# Altium schematic sheet Encoder.SchDoc
size B; Author: E. Sims; Organization: Let's Build Rockets Inc.; SheetNumber: 2; SheetTotal: 3
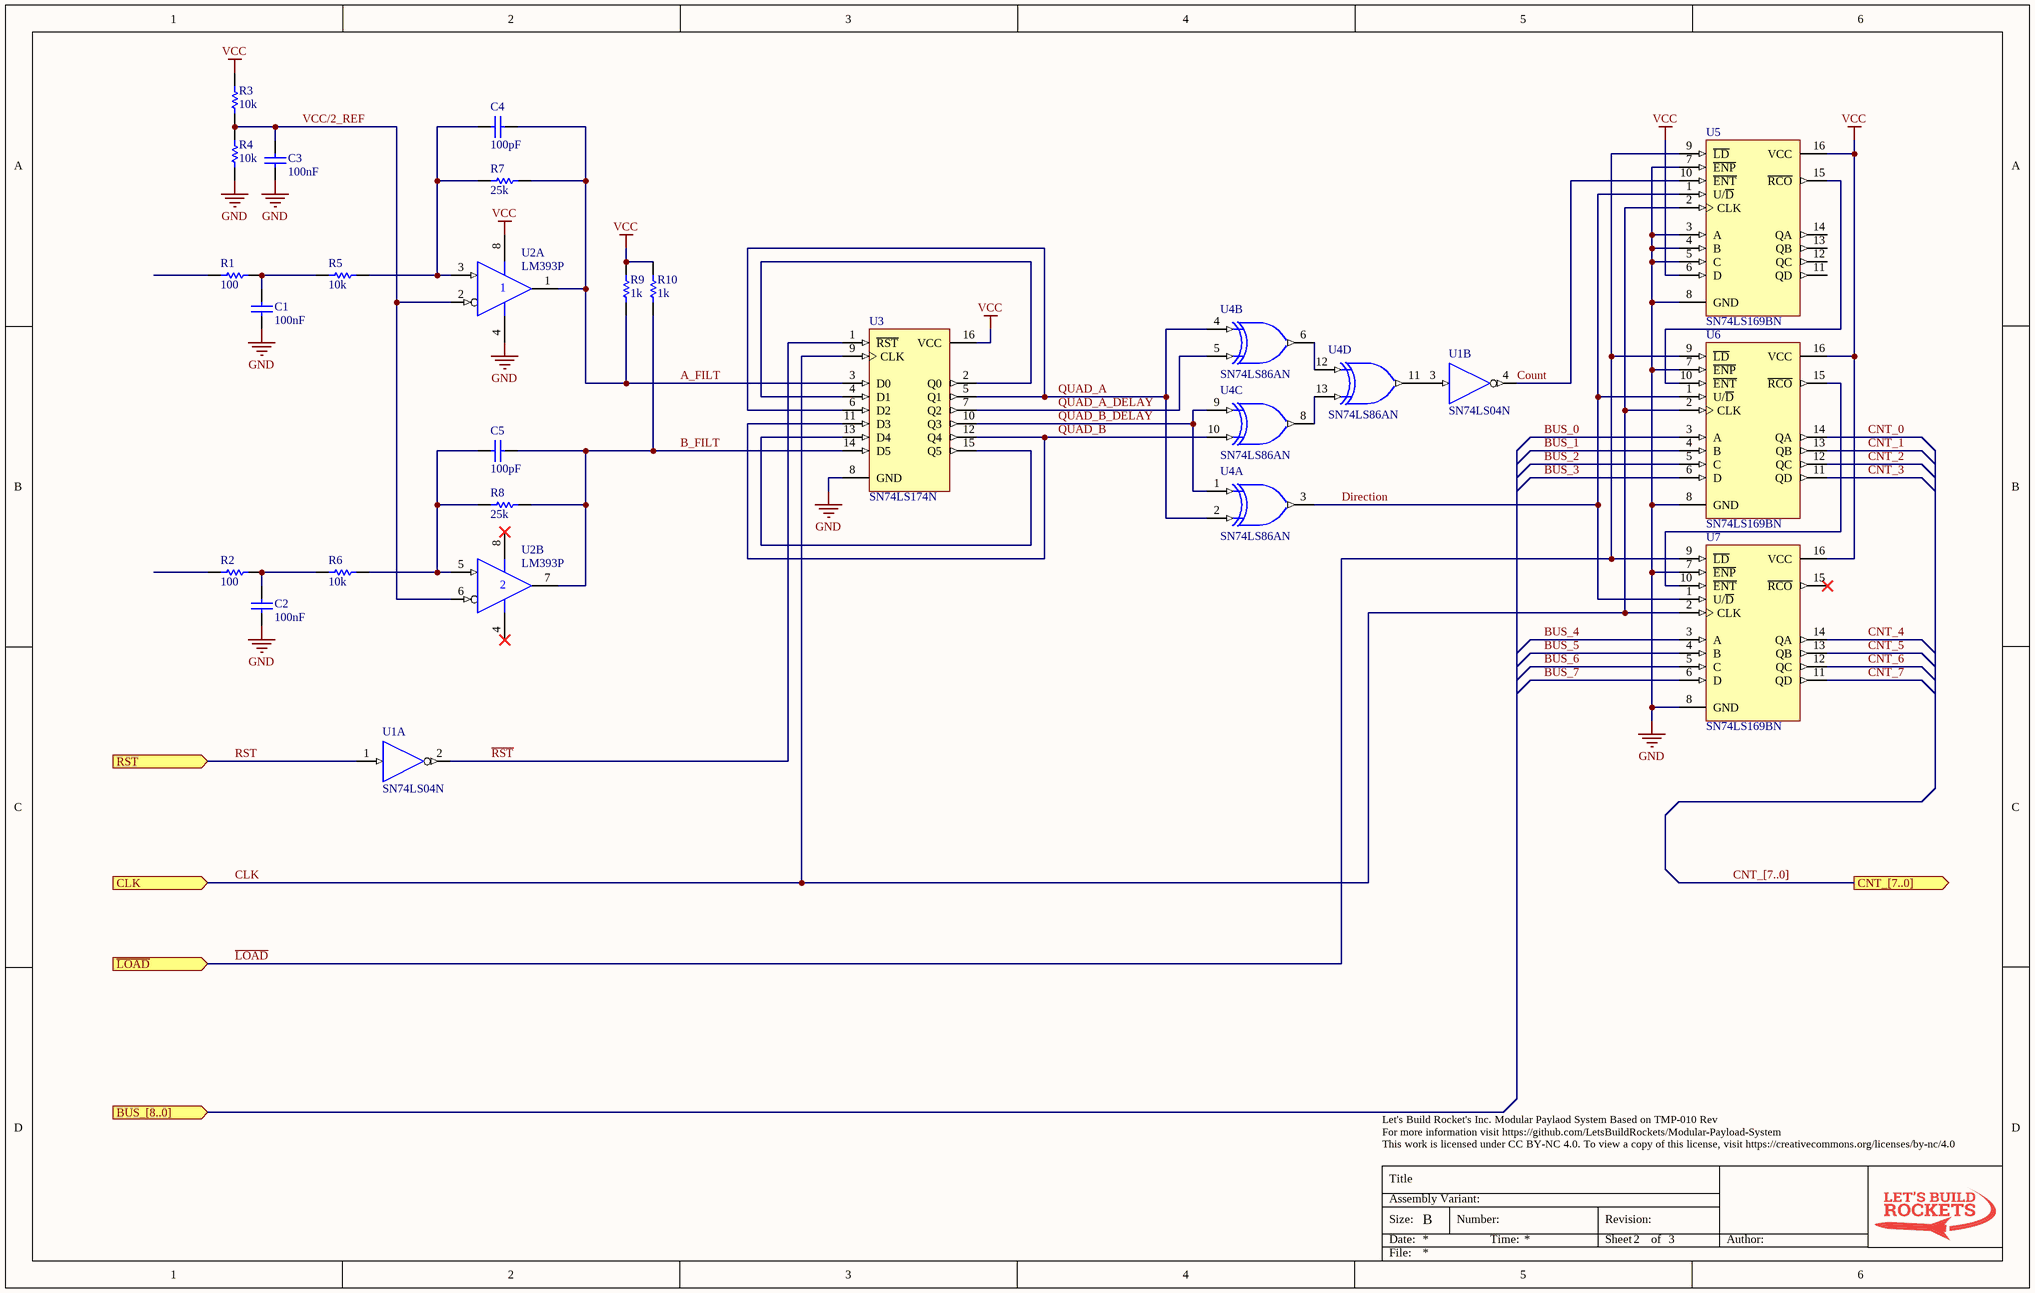
[diagram p0: Encoder.SchDoc]

## Parts
C1  value 100nF  [RAD-0.3]  (hidden comment: Cap)
C2  value 100nF  [RAD-0.3]  (hidden comment: Cap)
C3  value 100nF  [RAD-0.3]  (hidden comment: Cap)
C4  value 100pF  [RAD-0.3]  (hidden comment: Cap)
C5  value 100pF  [RAD-0.3]  (hidden comment: Cap)
R1  value 100  [AXIAL-0.3]  (hidden comment: Res1)
R2  value 100  [AXIAL-0.3]  (hidden comment: Res1)
R3  value 10k  [AXIAL-0.3]  (hidden comment: Res1)
R4  value 10k  [AXIAL-0.3]  (hidden comment: Res1)
R5  value 10k  [AXIAL-0.3]  (hidden comment: Res1)
R6  value 10k  [AXIAL-0.3]  (hidden comment: Res1)
R7  value 25k  [AXIAL-0.3]  (hidden comment: Res1)
R8  value 25k  [AXIAL-0.3]  (hidden comment: Res1)
R9  value 1k  [AXIAL-0.3]  (hidden comment: Res1)
R10  value 1k  [AXIAL-0.3]  (hidden comment: Res1)
U1  SN74LS04N  [N014]  (parts A,B of 6)
U2  LM393P  [P008]  (parts A,B of 2)
U3  SN74LS174N  [N016]
U4  SN74LS86AN  [N014]  (parts A,B,C,D of 4)
U5  SN74LS169BN  [N016]
U6  SN74LS169BN  [N016]
U7  SN74LS169BN  [N016]

## Ports
BUS_[8..0] (in), CLK (in), CNT_[7..0] (out), RST (in), ~{LOAD} (in)

## Nets
GND: C1.2 C2.2 C3.2 R4.2 U1.7(GND) U2.4(GND) U3.8(GND) U4.7(GND) U5.3(A) U5.4(B) U5.5(C) U5.7(~{ENP}) U5.8(GND) U6.7(~{ENP}) U6.8(GND) U7.7(~{ENP}) U7.8(GND)
VCC: R3.1 R9.1 R10.1 U1.14(VCC) U2.8(VCC) U3.16(VCC) U4.14(VCC) U5.6(D) U5.16(VCC) U6.16(VCC) U7.16(VCC)
A_FILT: C4.1 R7.1 R9.2 U2.1(OUT) U3.3(D0)
B_FILT: C5.1 R8.1 R10.2 U2.7(OUT) U3.14(D5)
BUS_0: U6.3(A)
BUS_1: U6.4(B)
BUS_2: U6.5(C)
BUS_3: U6.6(D)
BUS_4: U7.3(A)
BUS_5: U7.4(B)
BUS_6: U7.5(C)
BUS_7: U7.6(D)
CLK: U3.9(CLK) U5.2(CLK) U6.2(CLK) U7.2(CLK) ; port CLK
CNT_0: U6.14(QA)
CNT_1: U6.13(QB)
CNT_2: U6.12(QC)
CNT_3: U6.11(QD)
CNT_4: U7.14(QA)
CNT_5: U7.13(QB)
CNT_6: U7.12(QC)
CNT_7: U7.11(QD)
Count: U1.4(Y) U5.10(~{ENT})
Direction: U4.3(Y) U5.1(U/~{D}) U6.1(U/~{D}) U7.1(U/~{D})
~{LOAD}: U5.9(~{LD}) U6.9(~{LD}) U7.9(~{LD}) ; port ~{LOAD}
QUAD_A: U3.5(Q1) U3.6(D2) U4.2(B) U4.4(A)
QUAD_A_DELAY: U3.7(Q2) U4.5(B)
QUAD_B: U3.11(D3) U3.12(Q4) U4.10(B)
QUAD_B_DELAY: U3.10(Q3) U4.1(A) U4.9(A)
~{RST}: U1.2(Y) U3.1(~{RST})
RST: U1.1(A) ; port RST
VCC/2_REF: C3.1 R3.2 R4.1 U2.2(IN-) U2.6(IN-)
NetC1_1: C1.1 R1.1 R5.2
NetC2_1: C2.1 R2.1 R6.2
NetC4_2: C4.2 R5.1 R7.2 U2.3(IN+)
NetC5_2: C5.2 R6.1 R8.2 U2.5(IN+)
NetU1_3: U1.3(A) U4.11(Y)
NetU3_2: U3.2(Q0) U3.4(D1)
NetU3_13: U3.13(D4) U3.15(Q5)
NetU4_6: U4.6(Y) U4.12(A)
NetU4_8: U4.8(Y) U4.13(B)
NetU5_15: U5.15(~{RCO}) U6.10(~{ENT})
NetU6_15: U6.15(~{RCO}) U7.10(~{ENT})

Not connected (* = marked no-connect by the designer): R1 2; R2 2; U5 11(QD) 12(QC) 13(QB) 14(QA); U7 15(~{RCO})*

## Buses and harness runs
bus CNT_[7..0] = port CNT_[7..0]

## Notes on the sheet
- Let's Build Rocket's Inc. Modular Paylaod System Based on TMP-010 Rev
  For more information visit https://github.com/LetsBuildRockets/Modular-Payload-System
  This work is licensed under CC BY-NC 4.0. To view a copy of this license, visit https://creativecommons.org/licenses/by-nc/4.0
- Title
- Size:
- Date:
- Assembly Variant:
- B
- Number:
- Time:
- Revision:
- Sheet
- of
- Author:
- File:

## Library data of the parts
C1-C5 = Cap: Capacitor; Published: 8-Jun-2000; LatestRevisionDate: 17-Jul-2002; LatestRevisionNote: Re-released for DXP Platform.; PackageReference: RAD-0.3; Publisher: Altium Limited; PackageDescription: Radial Cap, Thru-Hole; 2 Leads; 0.3 in Pin Spacing
R1-R10 = Res1: Resistor; Published: 8-Jun-2000; LatestRevisionDate: 17-Jul-2002; LatestRevisionNote: Re-released for DXP Platform.; PackageReference: AXIAL-0.3; Publisher: Altium Limited; PackageDescription: Axial Device, Thru-Hole; 2 Leads; 0.3 in Pin Spacing
U1 = SN74LS04N: Hex Inverter; Published: 8-Jun-2000; LatestRevisionDate: 04-Mar-2005; LatestRevisionNote: Stylized 3D Model Added.; DatasheetVersion: Mar-1988; PackageVersion: Oct-1995; PackageReference: N014; Publisher: Altium Limited; PackageDescription: DIP; 14 Leads; Row Spacing 7.62 mm; Pitch 2.54 mm; ComponentLink1Description: Manufacturer Link; ComponentLink1URL: http://www.ti.com/; ComponentLink2Description: Datasheet; ComponentLink2URL: http://www-s.ti.com/sc/ds/sn74ls04.pdf
U2 = LM393P: Dual Differential Comparator; Published: 15-Apr-2002; LatestRevisionDate: 04-Mar-2005; LatestRevisionNote: Stylized 3D Model Added.; DatasheetVersion: Nov-1988; PackageVersion: Jun-1999; PackageReference: P008; Publisher: Altium Limited; PackageDescription: DIP; 8 Leads; Row Spacing 7.62 mm; Pitch 2.54 mm; Code_JEDEC: MO-001-AN; ComponentLink1Description: Manufacturer Link; ComponentLink1URL: http://www.ti.com/; ComponentLink2Description: Datasheet; ComponentLink2URL: http://www-s.ti.com/sc/ds/lm193.pdf
U3 = SN74LS174N: Hex D-Type Flip-Flop with Clear; Published: 8-Jun-2000; LatestRevisionDate: 04-Mar-2005; LatestRevisionNote: Stylized 3D Model Added.; DatasheetVersion: Mar-1988; PackageVersion: Oct-1995; PackageReference: N016; Publisher: Altium Limited; PackageDescription: DIP; 16 Leads; Row Spacing 7.62 mm; Pitch 2.54 mm; Code_JEDEC: MS-001-BB; ComponentLink1Description: Manufacturer Link; ComponentLink1URL: http://www.ti.com/; ComponentLink2Description: Datasheet; ComponentLink2URL: http://www-s.ti.com/sc/ds/sn74175.pdf
U4 = SN74LS86AN: Quadruple 2-Input Exclusive-OR Gate; Published: 8-Jun-2000; LatestRevisionDate: 04-Mar-2005; LatestRevisionNote: Stylized 3D Model Added.; DatasheetVersion: Mar-1988; PackageVersion: Oct-1995; PackageReference: N014; Publisher: Altium Limited; PackageDescription: DIP; 14 Leads; Row Spacing 7.62 mm; Pitch 2.54 mm; ComponentLink1Description: Manufacturer Link; ComponentLink1URL: http://www.ti.com/; ComponentLink2Description: Datasheet; ComponentLink2URL: http://www-s.ti.com/sc/ds/sn74ls86a.pdf
U5-U7 = SN74LS169BN: Synchronous 4-Bit Up/Down Binary Counter; Published: 8-Jun-2000; LatestRevisionDate: 04-Mar-2005; LatestRevisionNote: Stylized 3D Model Added.; DatasheetVersion: Mar-1988; PackageVersion: Oct-1995; PackageReference: N016; Publisher: Altium Limited; PackageDescription: DIP; 16 Leads; Row Spacing 7.62 mm; Pitch 2.54 mm; Code_JEDEC: MS-001-BB; ComponentLink1Description: Manufacturer Link; ComponentLink1URL: http://www.ti.com/; ComponentLink2Description: Datasheet; ComponentLink2URL: http://www-s.ti.com/sc/ds/sn74ls169b.pdf